# Altium schematic sheet HC Standoff.SchDoc
size A; SheetNumber: 4; SheetTotal: 4
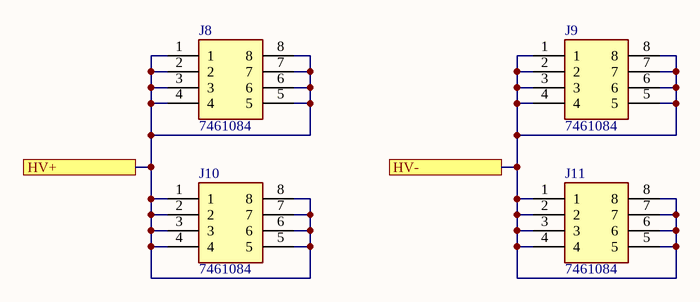
[diagram p0: HC Standoff.SchDoc]

## Parts
J8  7461084  [7461084]
J9  7461084  [7461084]
J10  7461084  [7461084]
J11  7461084  [7461084]

## Ports
HV+, HV-

## Nets
HV+: J8.1 J8.2 J8.3 J8.4 J8.5 J8.6 J8.7 J8.8 J10.1 J10.2 J10.3 J10.4 J10.5 J10.6 J10.7 J10.8 ; port HV+
HV-: J9.1 J9.2 J9.3 J9.4 J9.5 J9.6 J9.7 J9.8 J11.1 J11.2 J11.3 J11.4 J11.5 J11.6 J11.7 J11.8 ; port HV-

## Library data of the parts
J8-J11 = 7461084: Connector; Manufacturer_Name: Wurth Elektronik; Datasheet Link: https://www.we-online.com/components/products/datasheet/7461084.pdf; Height: 13.5mm; Manufacturer_Part_Number: 7461084; Mouser Part Number: 710-7461084; Mouser Price/Stock: https://www.mouser.co.uk/ProductDetail/Wurth-Elektronik/7461084?qs=lykWx4dhCCHlOeuPuO4BAQ%3D%3D